# Altium schematic sheet VC_PanelCons.SchDoc: Debug Panel Connections
size A4; SheetNumber: 4; SheetTotal: 4; FileInfo: VC_PanelCons.SchDoc
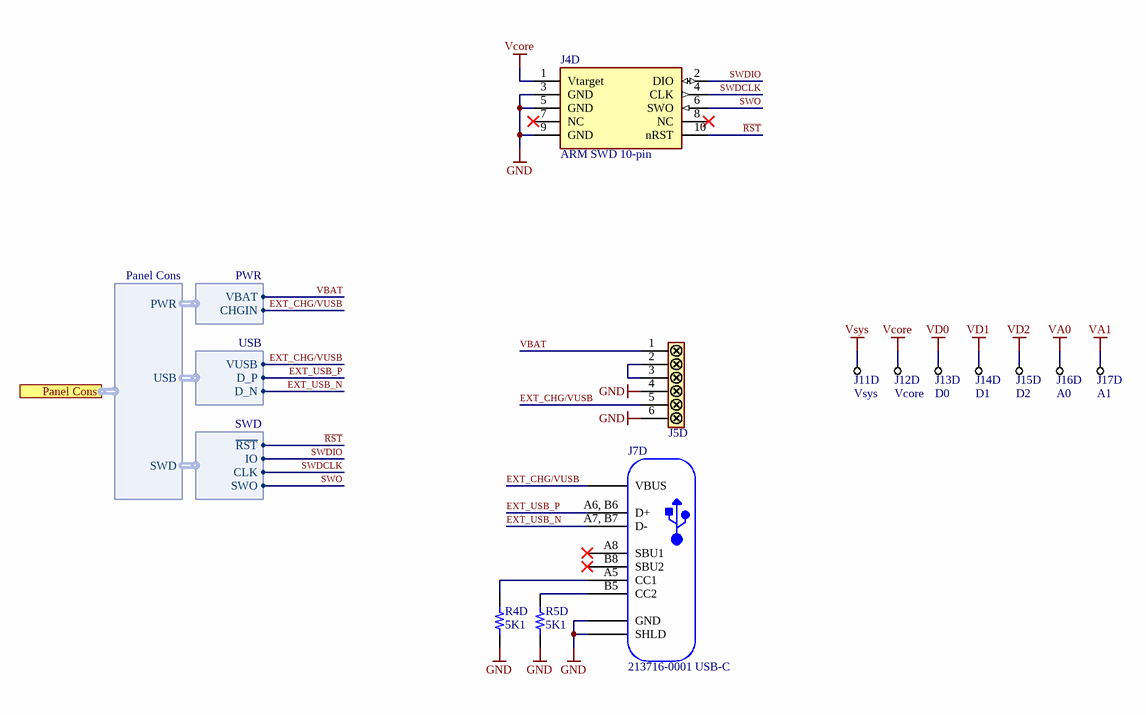
[diagram p0: VC_PanelCons.SchDoc]

## Parts
J4D  ARM SWD 10-pin  [CONN_SWD]
J5D  6Pin  [CONN_PINHEADER_6PIN]  (value not drawn)
J7D  213716-0001 USB-C  [CONN_USBC_2137160001]
J11D  Vsys  [PADSMD_ROUND]  (no BOM)
J12D  Vcore  [PADSMD_ROUND]  (no BOM)
J13D  D0  [PADSMD_ROUND]  (no BOM)
J14D  D1  [PADSMD_ROUND]  (no BOM)
J15D  D2  [PADSMD_ROUND]  (no BOM)
J16D  A0  [PADSMD_ROUND]  (no BOM)
J17D  A1  [PADSMD_ROUND]  (no BOM)
R4D  5K1  [RES_0402]
R5D  5K1  [RES_0402]

## Ports
Panel Cons (harness Panel Cons)

## Harnesses
PWR: CHGIN, VBAT
SWD: ~{RST}, IO, CLK, SWO
Panel Cons: PWR, USB, SWD
USB: VUSB, D_P, D_N

## Nets
GND: J4D.3(GND) J4D.5(GND) J4D.9(GND) J5D.4 J5D.6 J7D.0(SHLD) J7D.A1(GND) R4D.1 R5D.1
VA0: J16D.0
VA1: J17D.0
Vcore: J4D.1(Vtarget) J12D.0
VD0: J13D.0
VD1: J14D.0
VD2: J15D.0
Vsys: J11D.0
EXT_CHG/VUSB: J5D.5 J7D.A4(VBUS) ; harness PWR.CHGIN, harness USB.VUSB
EXT_USB_N: J7D.A7,_B7(D-) ; harness USB.D_N
EXT_USB_P: J7D.A6,_B6(D+) ; harness USB.D_P
~{RST}: J4D.10(nRST) ; harness SWD.~{RST}
SWDCLK: J4D.4(CLK) ; harness SWD.CLK
SWDIO: J4D.2(DIO) ; harness SWD.IO
SWO: J4D.6(SWO) ; harness SWD.SWO
VBAT: J5D.1 ; harness PWR.VBAT
NetJ5D_2: J5D.2 J5D.3
NetJ7D_A5: J7D.A5(CC1) R4D.2
NetJ7D_B5: J7D.B5(CC2) R5D.2

Not connected (* = marked no-connect by the designer): J4D 7(NC)* 8(NC)*; J7D A8(SBU1)* B8(SBU2)*

## Notes on the sheet
- Project:
- Laboratory:
- Date:
- File:
- Rev:
- Variant:
- License:
- Drawn By:
- Checked By:
- Sheet:
- /

## Library data of the parts
J4D = CONN_SWD: ARM 10-pin SWD Connector.; Supplier 1: Mouser; Supplier Part Number 1: 710-62201021121
J5D = CONN_PINHEADER_6PIN: 6 Pin Pinheader.
J7D = CONN_USB_C: Connector USB Type C Receptacle 16 Position 0.5mm Surface Mount Right Angle Emboss T/R; pin to pad: A1>A1+B12+A12+B1 A4>A4+B9+A9+B4 A6, B6>A6+B6 A7, B7>A7+B7; Manufacturer: Molex; Manufacturer Part Number: 213716-0001; Supplier 1: Mouser; Supplier Part Number 1: 538-213716-0001
J11D J12D J13D J14D J15D J16D J17D = PADSMD: SMD Pad
R4D R5D = R_0402_5K1: R 5120R 1% 100mW 0402; Manufacturer: Panasonic; Manufacturer Part Number: ERJ-2RKF5101X; Supplier 1: Mouser; Supplier Part Number 1: 667-ERJ-2RKF5101X